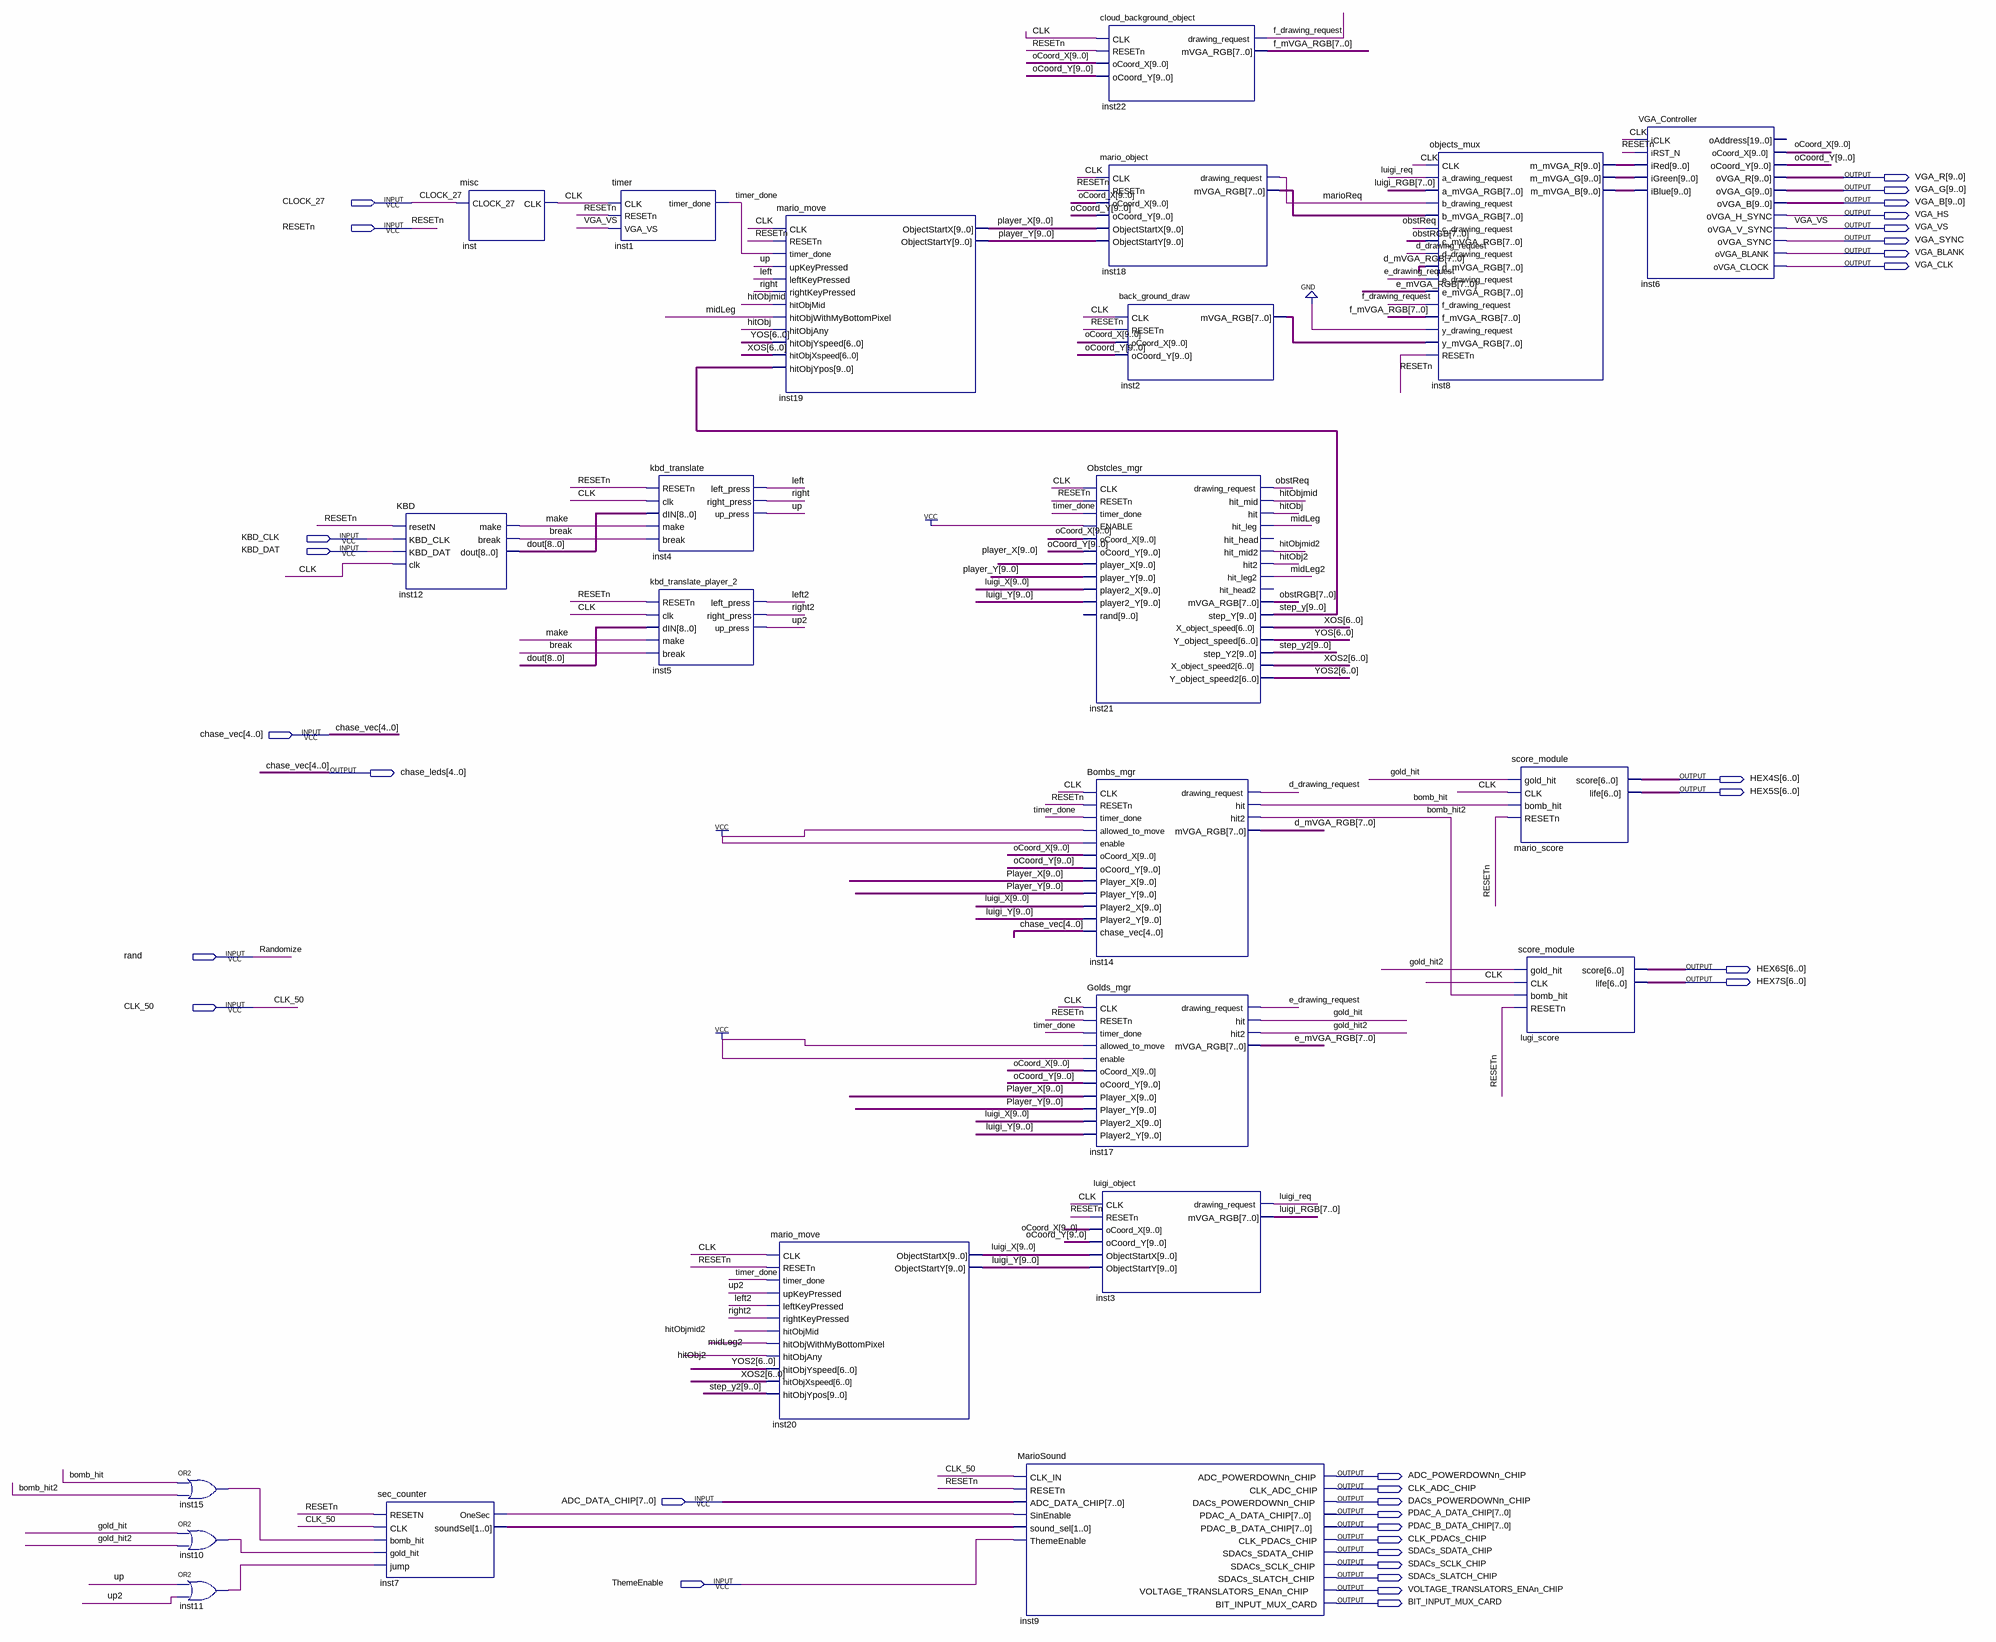
[diagram p0: schematic sheet]
// Quartus schematic TOP_SIFTACH.bdf as structural Verilog: 23 symbols, 33 pins
module TOP_SIFTACH (
  input  CLOCK_27,
  input  RESETn,
  input  KBD_CLK,
  input  KBD_DAT,
  input  [4:0] chase_vec,
  input  \rand ,
  input  CLK_50,
  input  [7:0] ADC_DATA_CHIP,
  input  ThemeEnable,
  output [9:0] VGA_R,
  output [9:0] VGA_G,
  output [9:0] VGA_B,
  output VGA_HS,
  output VGA_VS,
  output VGA_SYNC,
  output VGA_BLANK,
  output VGA_CLK,
  output [4:0] chase_leds,
  output [6:0] HEX4S,
  output [6:0] HEX5S,
  output [6:0] HEX6S,
  output [6:0] HEX7S,
  output ADC_POWERDOWNn_CHIP,
  output CLK_ADC_CHIP,
  output DACs_POWERDOWNn_CHIP,
  output [7:0] PDAC_A_DATA_CHIP,
  output [7:0] PDAC_B_DATA_CHIP,
  output CLK_PDACs_CHIP,
  output SDACs_SDATA_CHIP,
  output SDACs_SCLK_CHIP,
  output SDACs_SLATCH_CHIP,
  output VOLTAGE_TRANSLATORS_ENAn_CHIP,
  output BIT_INPUT_MUX_CARD
);

  wire bomb_hit, bomb_hit2, \break , CLK, d_drawing_request, e_drawing_request, f_drawing_request, gold_hit,
       gold_hit2, hitObj, hitObj2, hitObjmid, hitObjmid2, inst7_onesec, inst10_out, inst11_out, inst15_out,
       left, left2, luigi_req, make, marioReq, midLeg, midLeg2, obstReq, right, right2, timer_done, up, up2;
  wire [1:0] inst7_soundsel;
  wire [6:0] XOS, XOS2, YOS, YOS2;
  wire [7:0] d_mVGA_RGB, e_mVGA_RGB, f_mVGA_RGB, inst2_mvga_rgb, inst18_mvga_rgb, luigi_RGB, obstRGB;
  wire [8:0] dout;
  wire [9:0] inst8_m_mvga_b, inst8_m_mvga_g, inst8_m_mvga_r, luigi_X, luigi_Y, oCoord_X, oCoord_Y, player_X,
       player_Y, step_y, step_y2;

  or inst15 (inst15_out, bomb_hit, bomb_hit2);
  or inst10 (inst10_out, gold_hit, gold_hit2);
  or inst11 (inst11_out, up, up2);
  sec_counter inst7 (
    .RESETN(RESETn), .CLK(CLK_50), .bomb_hit(inst15_out), .gold_hit(inst10_out), .jump(inst11_out),
    .OneSec(inst7_onesec), .soundSel(inst7_soundsel));
  KBD inst12 (
    .resetN(RESETn), .KBD_CLK(KBD_CLK), .KBD_DAT(KBD_DAT), .clk(CLK), .make(make), .\break (\break ),
    .dout(dout));
  misc inst (.CLOCK_27(CLOCK_27), .CLK(CLK));
  timer inst1 (.CLK(CLK), .RESETn(RESETn), .VGA_VS(VGA_VS), .timer_done(timer_done));
  kbd_translate inst4 (
    .RESETn(RESETn), .clk(CLK), .dIN(dout), .make(make), .\break (\break ), .left_press(left),
    .right_press(right), .up_press(up));
  kbd_translate_player_2 inst5 (
    .RESETn(RESETn), .clk(CLK), .dIN(dout), .make(make), .\break (\break ), .left_press(left2),
    .right_press(right2), .up_press(up2));
  mario_move inst19 (
    .CLK(CLK), .RESETn(RESETn), .timer_done(timer_done), .upKeyPressed(up), .leftKeyPressed(left),
    .rightKeyPressed(right), .hitObjMid(hitObjmid), .hitObjWithMyBottomPixel(midLeg), .hitObjAny(hitObj),
    .hitObjYspeed(YOS), .hitObjXspeed(XOS), .hitObjYpos(step_y), .ObjectStartX(player_X),
    .ObjectStartY(player_Y));
  mario_move inst20 (
    .CLK(CLK), .RESETn(RESETn), .timer_done(timer_done), .upKeyPressed(up2), .leftKeyPressed(left2),
    .rightKeyPressed(right2), .hitObjMid(hitObjmid2), .hitObjWithMyBottomPixel(midLeg2), .hitObjAny(hitObj2),
    .hitObjYspeed(YOS2), .hitObjXspeed(XOS2), .hitObjYpos(step_y2), .ObjectStartX(luigi_X),
    .ObjectStartY(luigi_Y));
  MarioSound inst9 (
    .CLK_IN(CLK_50), .RESETn(RESETn), .ADC_DATA_CHIP(ADC_DATA_CHIP), .SinEnable(inst7_onesec),
    .sound_sel(inst7_soundsel), .ThemeEnable(ThemeEnable), .ADC_POWERDOWNn_CHIP(ADC_POWERDOWNn_CHIP),
    .CLK_ADC_CHIP(CLK_ADC_CHIP), .DACs_POWERDOWNn_CHIP(DACs_POWERDOWNn_CHIP),
    .PDAC_A_DATA_CHIP(PDAC_A_DATA_CHIP), .PDAC_B_DATA_CHIP(PDAC_B_DATA_CHIP),
    .CLK_PDACs_CHIP(CLK_PDACs_CHIP), .SDACs_SDATA_CHIP(SDACs_SDATA_CHIP), .SDACs_SCLK_CHIP(SDACs_SCLK_CHIP),
    .SDACs_SLATCH_CHIP(SDACs_SLATCH_CHIP), .VOLTAGE_TRANSLATORS_ENAn_CHIP(VOLTAGE_TRANSLATORS_ENAn_CHIP),
    .BIT_INPUT_MUX_CARD(BIT_INPUT_MUX_CARD));
  Obstcles_mgr inst21 (
    .CLK(CLK), .RESETn(RESETn), .timer_done(timer_done), .ENABLE(1'b1), .oCoord_X(oCoord_X),
    .oCoord_Y(oCoord_Y), .player_X(player_X), .player_Y(player_Y), .player2_X(luigi_X), .player2_Y(luigi_Y),
    .drawing_request(obstReq), .hit_mid(hitObjmid), .hit(hitObj), .hit_leg(midLeg), .hit_mid2(hitObjmid2),
    .hit2(hitObj2), .hit_leg2(midLeg2), .mVGA_RGB(obstRGB), .step_Y(step_y), .X_object_speed(XOS),
    .Y_object_speed(YOS), .step_Y2(step_y2), .X_object_speed2(XOS2), .Y_object_speed2(YOS2));  // open: rand, hit_head, hit_head2
  Bombs_mgr inst14 (
    .CLK(CLK), .RESETn(RESETn), .timer_done(timer_done), .allowed_to_move(1'b1), .enable(1'b1),
    .oCoord_X(oCoord_X), .oCoord_Y(oCoord_Y), .Player_X(player_X), .Player_Y(player_Y), .Player2_X(luigi_X),
    .Player2_Y(luigi_Y), .chase_vec(chase_vec), .drawing_request(d_drawing_request), .hit(bomb_hit),
    .hit2(bomb_hit2), .mVGA_RGB(d_mVGA_RGB));
  Golds_mgr inst17 (
    .CLK(CLK), .RESETn(RESETn), .timer_done(timer_done), .allowed_to_move(1'b1), .enable(1'b1),
    .oCoord_X(oCoord_X), .oCoord_Y(oCoord_Y), .Player_X(player_X), .Player_Y(player_Y), .Player2_X(luigi_X),
    .Player2_Y(luigi_Y), .drawing_request(e_drawing_request), .hit(gold_hit), .hit2(gold_hit2),
    .mVGA_RGB(e_mVGA_RGB));
  luigi_object inst3 (
    .CLK(CLK), .RESETn(RESETn), .oCoord_X(oCoord_X), .oCoord_Y(oCoord_Y), .ObjectStartX(luigi_X),
    .ObjectStartY(luigi_Y), .drawing_request(luigi_req), .mVGA_RGB(luigi_RGB));
  cloud_background_object inst22 (
    .CLK(CLK), .RESETn(RESETn), .oCoord_X(oCoord_X), .oCoord_Y(oCoord_Y),
    .drawing_request(f_drawing_request), .mVGA_RGB(f_mVGA_RGB));
  mario_object inst18 (
    .CLK(CLK), .RESETn(RESETn), .oCoord_X(oCoord_X), .oCoord_Y(oCoord_Y), .ObjectStartX(player_X),
    .ObjectStartY(player_Y), .drawing_request(marioReq), .mVGA_RGB(inst18_mvga_rgb));
  back_ground_draw inst2 (
    .CLK(CLK), .RESETn(RESETn), .oCoord_X(oCoord_X), .oCoord_Y(oCoord_Y), .mVGA_RGB(inst2_mvga_rgb));
  objects_mux inst8 (
    .CLK(CLK), .a_drawing_request(luigi_req), .a_mVGA_RGB(luigi_RGB), .b_drawing_request(marioReq),
    .b_mVGA_RGB(inst18_mvga_rgb), .c_drawing_request(obstReq), .c_mVGA_RGB(obstRGB),
    .d_drawing_request(d_drawing_request), .d_mVGA_RGB(d_mVGA_RGB), .e_drawing_request(e_drawing_request),
    .e_mVGA_RGB(e_mVGA_RGB), .f_drawing_request(f_drawing_request), .f_mVGA_RGB(f_mVGA_RGB),
    .y_drawing_request(1'b0), .y_mVGA_RGB(inst2_mvga_rgb), .RESETn(RESETn), .m_mVGA_R(inst8_m_mvga_r),
    .m_mVGA_G(inst8_m_mvga_g), .m_mVGA_B(inst8_m_mvga_b));
  score_module mario_score (
    .gold_hit(gold_hit), .CLK(CLK), .bomb_hit(bomb_hit), .RESETn(RESETn), .score(HEX4S), .life(HEX5S));
  score_module lugi_score (
    .gold_hit(gold_hit2), .CLK(CLK), .bomb_hit(bomb_hit2), .RESETn(RESETn), .score(HEX6S), .life(HEX7S));
  VGA_Controller inst6 (
    .iCLK(CLK), .iRST_N(RESETn), .iRed(inst8_m_mvga_r), .iGreen(inst8_m_mvga_g), .iBlue(inst8_m_mvga_b),
    .oCoord_X(oCoord_X), .oCoord_Y(oCoord_Y), .oVGA_R(VGA_R), .oVGA_G(VGA_G), .oVGA_B(VGA_B),
    .oVGA_H_SYNC(VGA_HS), .oVGA_V_SYNC(VGA_VS), .oVGA_SYNC(VGA_SYNC), .oVGA_BLANK(VGA_BLANK),
    .oVGA_CLOCK(VGA_CLK));  // open: oAddress

  assign chase_leds = chase_vec;

  // Other names for the same wires on the sheet: Randomize = \rand 
endmodule
